# EasyEDA Pro project 毕设.eprj, board PCB1
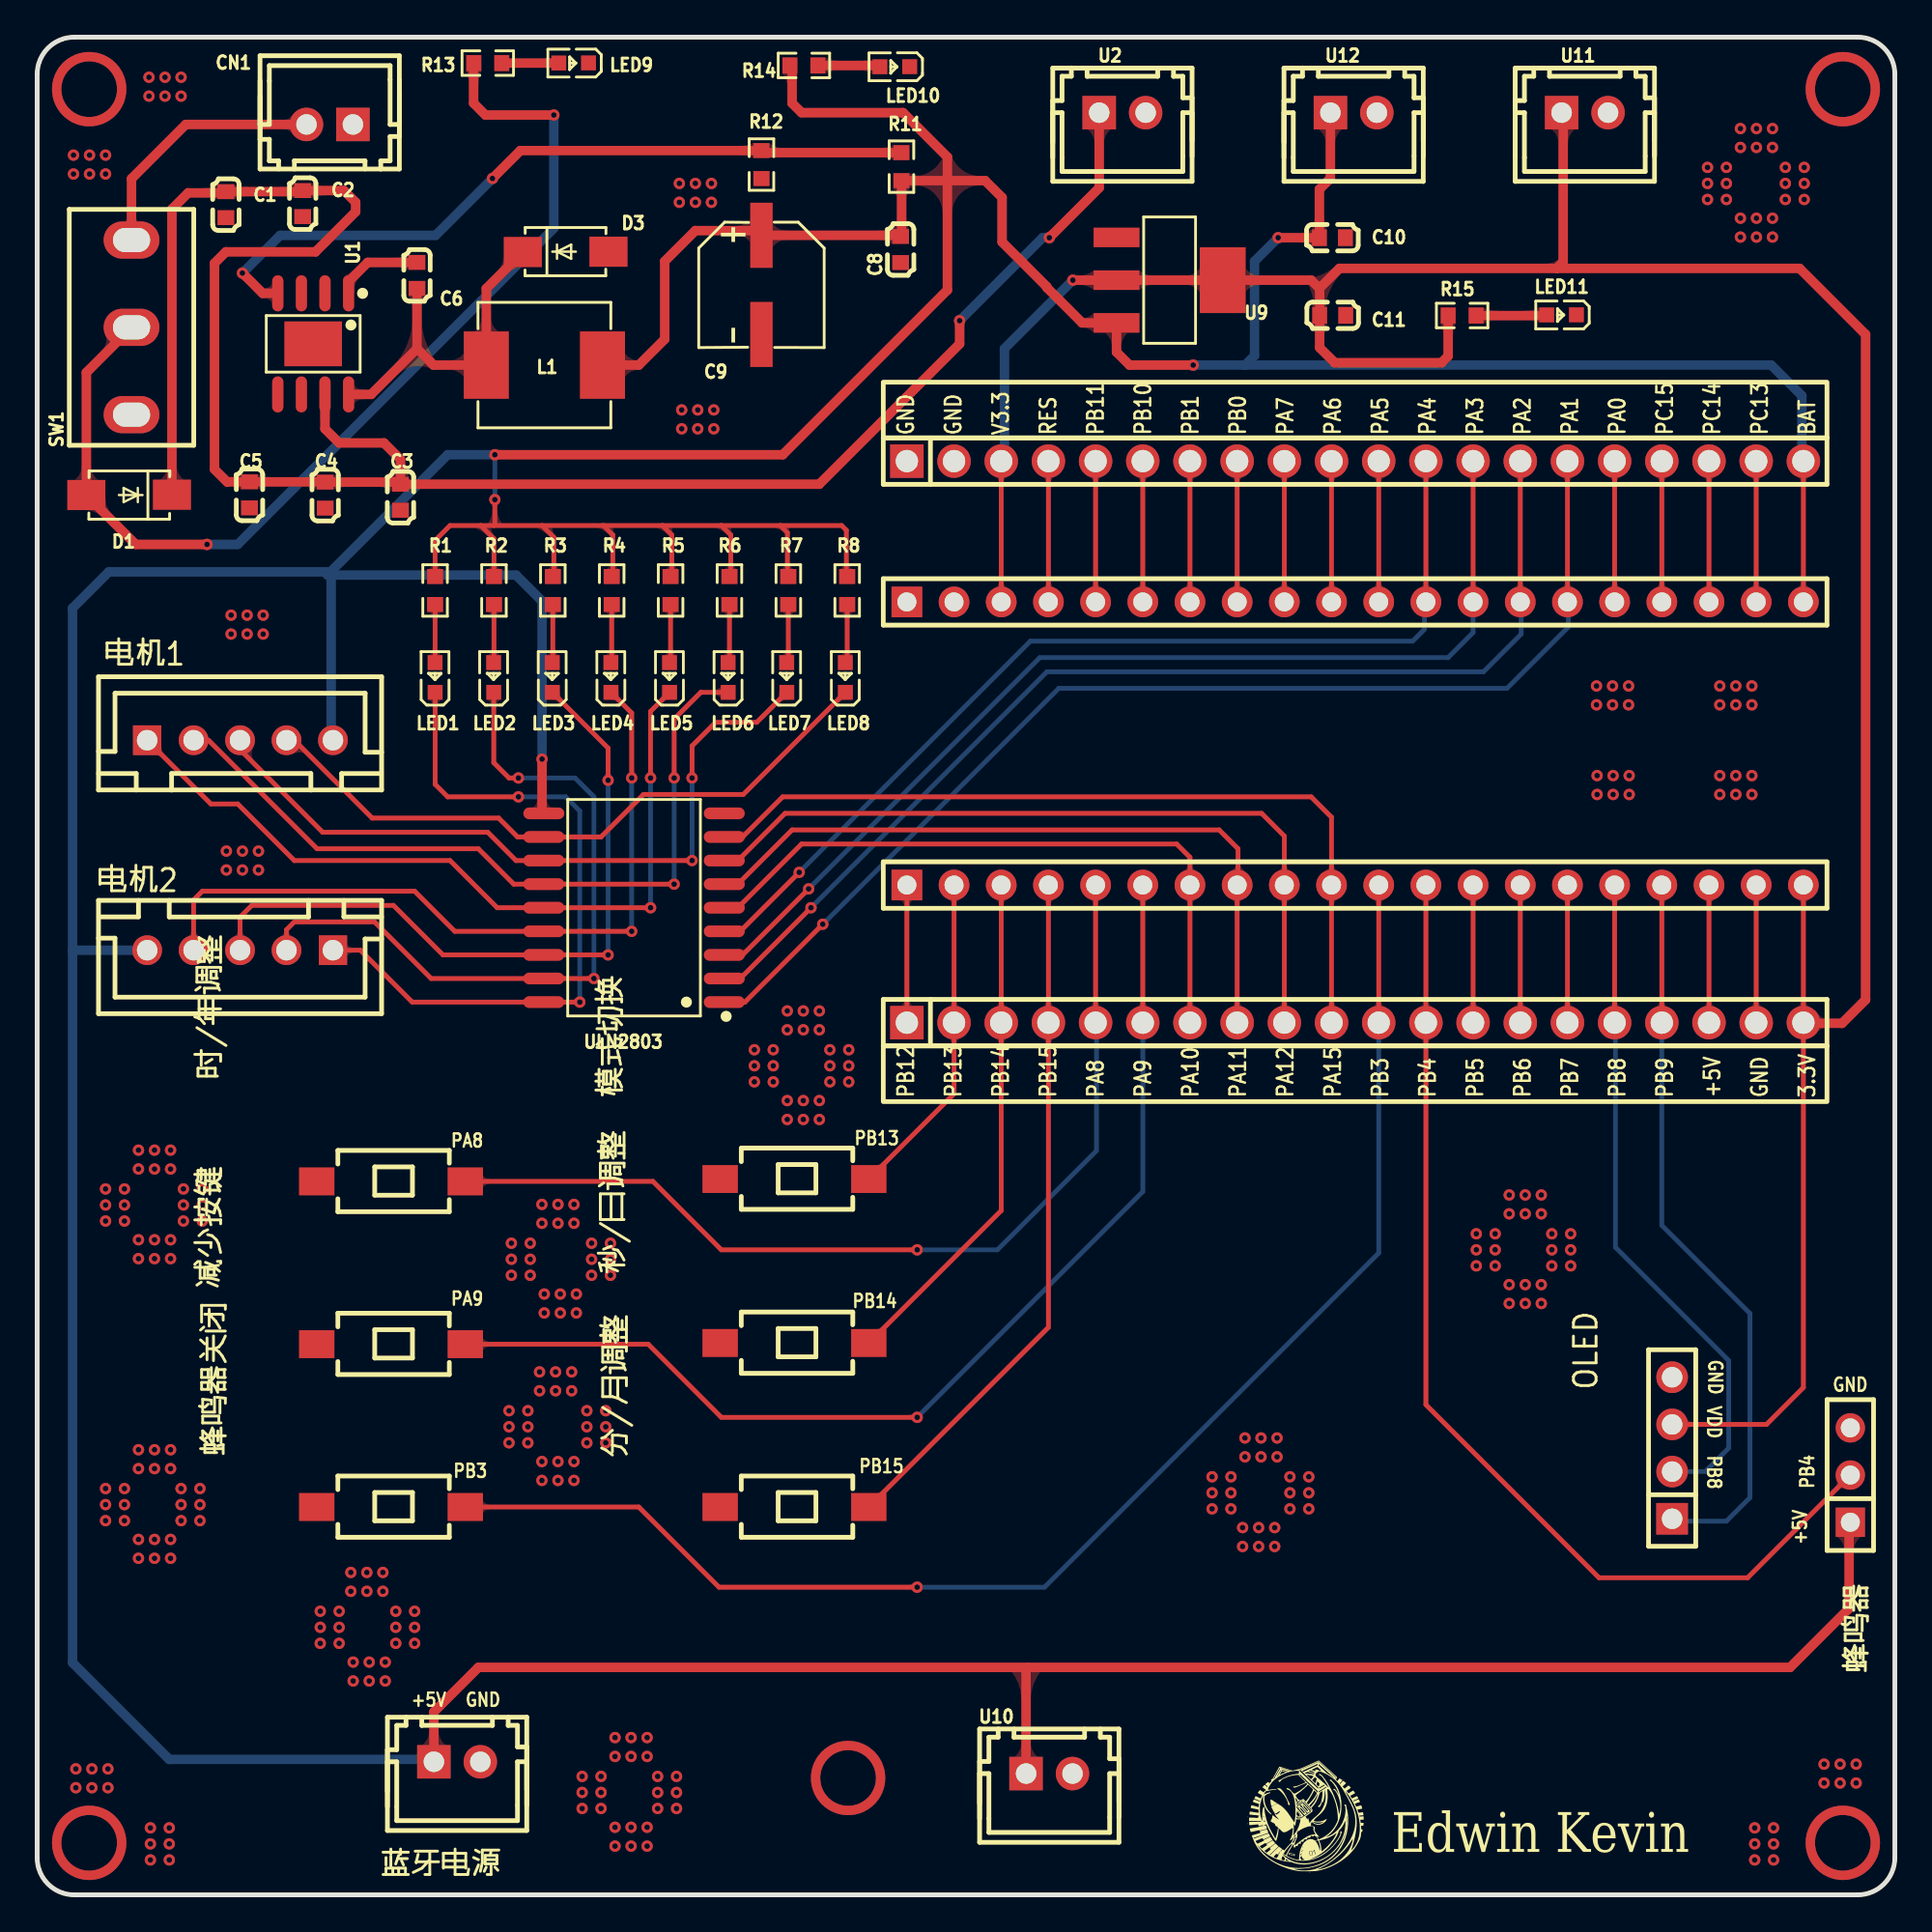
[diagram p1: board, top side]
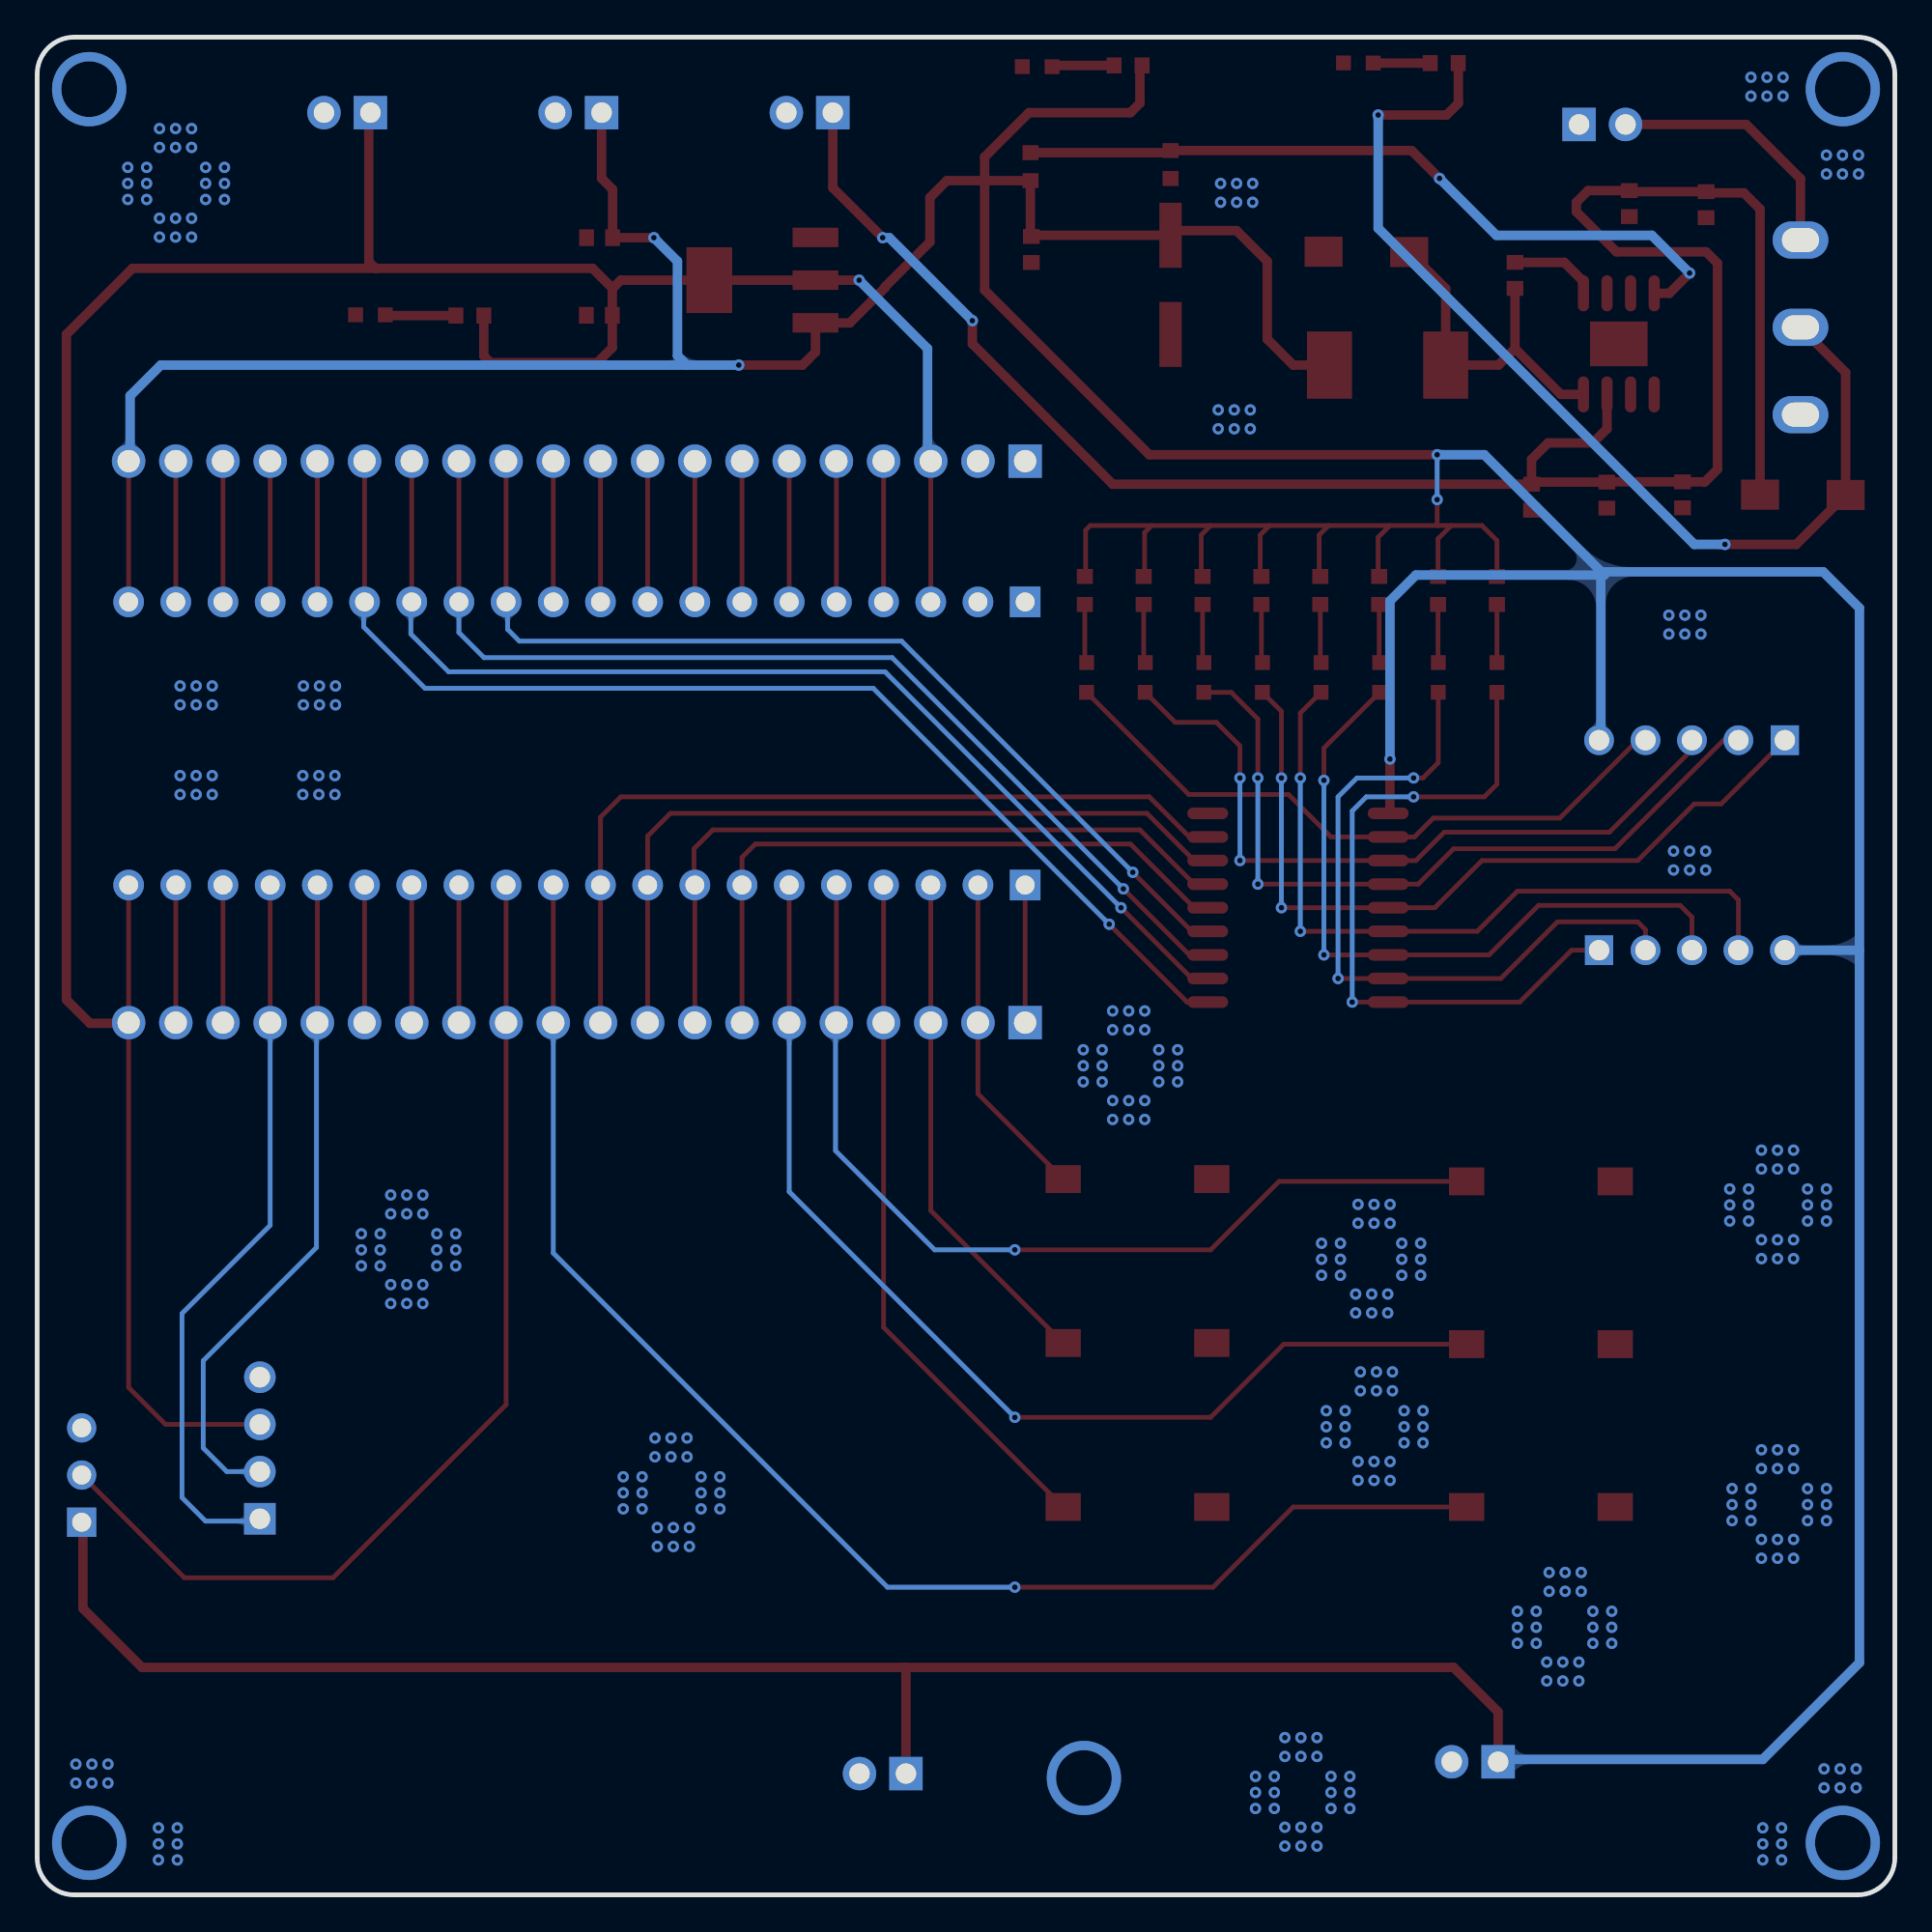
[diagram p2: board, bottom side, seen from below]

Outline 100 x 100 mm; copper layers: Top Layer, Bottom Layer. Coordinates in mm from the lower left corner of the outline.
Outline path: 0,98 0,2 arc(0.59,0.59) 2,0 98,0 arc(99.41,0.59) 100,2 100,98 arc(99.41,99.41) 98,100 2,100 arc(0.59,99.41) 0,98
Stack: Top Layer 0.035mm / Dielectric1 1.51mm FR4 er 4.5 / Bottom Layer 0.035mm

## Design rules (mm)
template: JLCPCB Capability(Two Layers Board)
spacing copperThickness1oz (default): track to track 0.102, other pairs 0.152 to 0.3
spacing copperThickness2oz: track to track 0.203, other pairs 0.152 to 0.3
track width copperThickness1oz (default): min 0.127, default 0.254, max 2.54
track width copperThickness2oz: min 0.203, default 0.254, max 2.54
differential pair differentialPair (default): width min 0.127, default 0.254, max 2.54; gap min 0.152, default 0.152
via viaSize (default): diameter min 0.5, default 0.61, max 10; hole min 0.3, default 0.305, max 6.3

## Placement (name value [footprint] x y rotation side)
C1  100nF  [C0603]  10.16 90.98 270 top
C2  100nF  [C0603]  14.29 91.04 270 top
C3  4.7μF  [C0603]  19.56 75.23 90 top
C4  4.7μF  [C0603]  15.5 75.35 90 top
C5  0.01μF  [C0603]  11.43 75.36 90 top
C6  0.01μF  [C0603]  20.45 87.18 270 top
C8  0.01μF  [C0603]  46.48 88.57 90 top
C9  330uF  [CAP-SMD_BD6.3-L6.6-W6.6-LS7.3-FD]  38.99 86.67 270 top
C10  10μF  [C0603]  69.72 89.2 0 top
C11  10μF  [C0603]  69.74 85.03 180 top
CN1  ZX-XH2.54-2PZZ  [CONN-TH_2P-P2.50_HX25003-2A]  15.75 95.3 180 top
D1  SS54  [SMA_L4.3-W2.6-LS5.0-FD]  4.95 75.36 0 top
D3  SS54  [SMA_L4.3-W2.6-LS5.0-FD]  28.45 88.44 180 top
H2  -  [HDR-TH_20P-P2.54-V-M-1]  70.95 46.95 0 top
H3  -  [HDR-TH_20P-P2.54-V-M-1]  70.95 77.18 0 top
L1  15uH  [IND-SMD_L7.0-W6.6_FXL0630]  27.31 82.35 180 top
LED1  -  [LED_0603]  21.41 65.58 90 top
LED2  -  [LED_0603]  24.57 65.58 90 top
LED3  -  [LED_0603]  27.72 65.58 90 top
LED4  -  [LED_0603]  30.88 65.58 90 top
LED5  -  [LED_0603]  34.03 65.58 90 top
LED6  -  [LED_0603]  37.19 65.58 90 top
LED7  -  [LED_0603]  40.34 65.58 90 top
LED8  -  [LED_0603]  43.5 65.58 90 top
LED9  -  [LED_0603]  28.83 98.6 180 top
LED10  -  [LED_0603]  46.12 98.4 180 top
LED11  -  [LED_0603]  82.01 85.04 180 top
OLED  -  [HDR-TH_4P-P2.54-V-F]  88.01 24.05 90 top
R1  10K  [R0603]  21.42 70.21 90 top
R2  10K  [R0603]  24.59 70.21 90 top
R3  10K  [R0603]  27.76 70.21 90 top
R4  10K  [R0603]  30.93 70.21 90 top
R5  10K  [R0603]  34.1 70.21 90 top
R6  10K  [R0603]  37.27 70.21 90 top
R7  10K  [R0603]  40.44 70.21 90 top
R8  10K  [R0603]  43.6 70.21 90 top
R11  10K  [R0603]  46.52 93.03 270 top
R12  3KΩ  [R0603]  38.99 93.14 90 top
R13  10K  [R0603]  24.26 98.6 180 top
R14  10K  [R0603]  41.28 98.48 0 top
R15  10K  [R0603]  76.71 85.01 0 top
SW1  SS-12D10L5  [SW-TH_SS-12D10L5]  5.08 84.38 90 top
U1  TPS5450QDDARQ1  [SOIC-8_L4.9-W3.9-P1.27-LS6.0-BL-EP]  14.86 83.49 180 top
U2  ZX-XH2.54-2PZZ  [CONN-TH_2P-P2.50_HX25003-2A]  58.42 95.94 0 top
U7  PM254-1-20-Z-8.5  [HDR-TH_20P-P2.54-V-F-2]  70.95 54.36 0 top
U8  PM254-1-20-Z-8.5  [HDR-TH_20P-P2.54-V-F-2]  70.95 69.6 0 top
U9  LM1117IMPX-3.3/NOPB  [SOT-223_L6.5-W3.5-P2.30-LS7.0-BR]  60.96 86.92 180 top
U10  ZX-XH2.54-2PZZ  [CONN-TH_2P-P2.50_HX25003-2A]  54.48 6.53 0 top
U11  ZX-XH2.54-2PZZ  [CONN-TH_2P-P2.50_HX25003-2A]  83.31 95.94 0 top
U12  ZX-XH2.54-2PZZ  [CONN-TH_2P-P2.50_HX25003-2A]  70.87 95.94 0 top
ULN2803  ULN2803  [SOP-18_L11.6-W7.5-P1.27-LS10.3-BL]  32.13 53.14 90 top
减少按键  TS-1101-C-W  [SW-SMD_L6.0-W3.3-LS8.0]  19.05 29.64 180 top
分/月调整  TS-1101-C-W  [SW-SMD_L6.0-W3.3-LS8.0]  40.77 20.88 180 top
时/年调整  TS-1101-C-W  [SW-SMD_L6.0-W3.3-LS8.0]  19.05 38.41 180 top
模式切换  TS-1101-C-W  [SW-SMD_L6.0-W3.3-LS8.0]  40.77 38.53 180 top
电机1  电机1  [CONN-TH_5P-P2.50_ZX-XH2.54-5PZZ]  10.92 62.15 0 top
电机2  电机2  [CONN-TH_5P-P2.50_ZX-XH2.54-5PZZ]  10.92 50.85 180 top
秒/日调整  TS-1101-C-W  [SW-SMD_L6.0-W3.3-LS8.0]  40.77 29.71 180 top
蓝牙电源  ZX-XH2.54-2PZZ  [CONN-TH_2P-P2.50_HX25003-2A]  22.61 7.16 0 top
蜂鸣器  -  [HDR-TH_3P-P2.54-V-F]  97.6 22.6 90 top
蜂鸣器关闭  TS-1101-C-W  [SW-SMD_L6.0-W3.3-LS8.0]  19.05 20.88 180 top

## Footprints (pads in the part's own frame, mm; a bottom-side part is the same pattern mirrored in y, then rotated)
C0603
  rect 0.8x0.9 smd: 1(-0.7,0) 2(0.7,0)
CAP-SMD_BD6.3-L6.6-W6.6-LS7.3-FD
  rect 3.5x1.2 smd: 1(-2.67,0) 2(2.67,0)
CONN-TH_2P-P2.50_HX25003-2A
  rect 1.8x1.8 hole 1.1: 1(-1.25,0)
  round 1.8 hole 1.1: 2(1.25,0)
CONN-TH_5P-P2.50_ZX-XH2.54-5PZZ
  rect 1.524x1.6 hole 1.1: 1(-5,0)
  round 1.6 hole 1.1: 2(-2.5,0) 3(0,0) 4(2.5,0) 5(5,0)
HDR-TH_3P-P2.54-V-F
  rect 1.575x1.575 hole 1.02: 1(-2.54,0)
  round 1.575 hole 1.02: 2(0,0) 3(2.54,0)
HDR-TH_4P-P2.54-V-F
  rect 1.7x1.7 hole 1.1: 1(-3.81,0)
  round 1.7 hole 1.1: 2(-1.27,0) 3(1.27,0) 4(3.81,0)
HDR-TH_20P-P2.54-V-F-2
  rect 1.65x1.65 hole 1.02: 1(-24.13,0)
  round 1.65 hole 1.02: 2(-21.59,0) 3(-19.05,0) 4(-16.51,0) 5(-13.97,0) 6(-11.43,0) 7(-8.89,0) 8(-6.35,0) 9(-3.81,0) 10(-1.27,0) 11(1.27,0) 12(3.81,0) 13(6.35,0) 14(8.89,0) 15(11.43,0) 16(13.97,0) 17(16.51,0) 18(19.05,0) 19(21.59,0) 20(24.13,0)
HDR-TH_20P-P2.54-V-M-1
  rect 1.8x1.8 hole 1.2: 1(-24.13,0)
  round 1.8 hole 1.2: 2(-21.59,0) 3(-19.05,0) 4(-16.51,0) 5(-13.97,0) 6(-11.43,0) 7(-8.89,0) 8(-6.35,0) 9(-3.81,0) 10(-1.27,0) 11(1.27,0) 12(3.81,0) 13(6.35,0) 14(8.89,0) 15(11.43,0) 16(13.97,0) 17(16.51,0) 18(19.05,0) 19(21.59,0) 20(24.13,0)
IND-SMD_L7.0-W6.6_FXL0630
  rect 2.424x3.62 smd: 1(3.128,0) 2(-3.128,0)
LED_0603
  rect 0.8x0.8 smd: 1(-0.851,-0.01) 2(0.75,-0.005)
R0603
  rect 0.806x0.864 smd: 1(-0.753,0) 2(0.753,0)
SMA_L4.3-W2.6-LS5.0-FD
  rect 2.046x1.62 smd: 1(-2.304,-0.009) 2(2.304,0.009)
SOIC-8_L4.9-W3.9-P1.27-LS6.0-BL-EP
  oval 0.602x1.941 smd: 1(-1.905,-2.72) 2(-0.635,-2.72) 3(0.635,-2.72) 4(1.905,-2.72) 5(1.905,2.72) 6(0.635,2.72) 7(-0.635,2.72) 8(-1.905,2.72)
  rect 3.098x2.41 smd: 9(0,0)
SOP-18_L11.6-W7.5-P1.27-LS10.3-BL
  oval 0.63x2.2 smd: 1(-5.08,-4.857) 2(-3.81,-4.857) 3(-2.54,-4.857) 4(-1.27,-4.857) 5(0,-4.857) 6(1.27,-4.857) 7(2.54,-4.857) 8(3.81,-4.857) 9(5.08,-4.857) 10(5.08,4.857) 11(3.81,4.857) 12(2.54,4.857) 13(1.27,4.857) 14(0,4.857) 15(-1.27,4.857) 16(-2.54,4.857) 17(-3.81,4.857) 18(-5.08,4.857)
SOT-223_L6.5-W3.5-P2.30-LS7.0-BR
  rect 2.465x1.05 smd: 1(2.857,-2.3) 2(2.857,0) 3(2.857,2.3)
  rect 2.465x3.54 smd: 4(-2.857,0)
SW-SMD_L6.0-W3.3-LS8.0
  rect 1.9x1.5 smd: 1(-4,0) 2(4,0)
SW-TH_SS-12D10L5
  oval 2x3 hole 1.3x2: 1(-4.7,0) 2(0,0) 3(4.7,0)

## Nets
As in the schematic, except:
$1N15280: C6.2 D3.2 L1.1 U1.8
$1N15281: C6.1 U1.1

Pads without a net: U1 2 3 5

## Via types
v1: diameter 4, hole 2.999, Top Layer to Bottom Layer, 5 vias
v2: diameter 0.61, hole 0.305, Top Layer to Bottom Layer, 357 vias

## Routing (per net, layer and track width the routed paths; a pad name or vN(x,y) marks a point on that pad's centre or on a via; arc(x,y) is an arc through that point)
5V: length 7.4
  Top Layer w0.254: H2.18 U7.18
GND: length 7.4
  Top Layer w0.254: U7.19 H2.19
  vias: v2(1.96,93.65) v2(1.96,92.63) v2(2.08,6.78) v2(2.08,5.77) v2(2.82,93.65) v2(2.82,92.63) v2(2.95,6.78) v2(2.95,5.77) v2(3.68,93.65) v2(3.68,92.63) v2(3.68,38) v2(3.68,37.14) v2(3.68,36.27) v2(3.68,21.87) v2(3.68,21.01) v2(3.68,20.14) v2(3.81,6.78) v2(3.81,5.77) v2(4.7,38) v2(4.7,37.14) v2(4.7,36.27) v2(4.7,21.87) v2(4.7,21.01) v2(4.7,20.14) v2(5.45,40.09) v2(5.45,39.07) v2(5.45,35.26) v2(5.45,34.25) v2(5.45,23.96) v2(5.45,22.94) v2(5.45,19.13) v2(5.45,18.12) v2(6.02,97.84) v2(6.02,96.83) v2(6.1,3.61) v2(6.1,2.74) v2(6.1,1.88) v2(6.32,40.09) v2(6.32,39.07) v2(6.32,35.26) v2(6.32,34.25) v2(6.32,23.96) v2(6.32,22.94) v2(6.32,19.13) v2(6.32,18.12) v2(6.88,97.84) v2(6.88,96.83) v2(7.11,3.61) v2(7.11,2.74) v2(7.11,1.88) v2(7.18,40.09) v2(7.18,39.07) v2(7.18,35.26) v2(7.18,34.25) v2(7.18,23.96) v2(7.18,22.94) v2(7.18,19.13) v2(7.18,18.12) v2(7.75,97.84) v2(7.75,96.83) v2(7.75,21.87) v2(7.75,21.01) v2(7.75,20.14) v2(7.87,38) v2(7.87,37.14) v2(7.87,36.27) v2(8.76,21.87) v2(8.76,21.01) v2(8.76,20.14) v2(8.89,38) v2(8.89,37.14) v2(8.89,36.27) v2(10.19,56.19) v2(10.19,55.17) v2(10.44,68.89) v2(10.44,67.87) v2(11.05,56.19) v2(11.05,55.17) v2(11.3,68.89) v2(11.3,67.87) v2(11.91,56.19) v2(11.91,55.17) v2(12.17,68.89) v2(12.17,67.87) v2(15.24,15.27) v2(15.24,14.4) v2(15.24,13.54) v2(16.26,15.27) v2(16.26,14.4) v2(16.26,13.54) v2(16.88,17.36) v2(16.88,16.34) v2(17.01,12.53) v2(17.01,11.51) v2(17.75,17.36) v2(17.75,16.34) v2(17.87,12.53) v2(17.87,11.51) v2(18.61,17.36) v2(18.61,16.34) v2(18.74,12.53) v2(18.74,11.51) v2(19.3,15.27) v2(19.3,14.4) v2(19.3,13.54) v2(20.32,15.27) v2(20.32,14.4) v2(20.32,13.54) v2(25.4,26.06) v2(25.4,25.2) v2(25.4,24.33) v2(25.53,35.08) v2(25.53,34.21) v2(25.53,33.35) v2(26.42,26.06) v2(26.42,25.2) v2(26.42,24.33) v2(26.54,35.08) v2(26.54,34.21) v2(26.54,33.35) v2(27.04,28.15) v2(27.04,27.13) v2(27.17,37.17) v2(27.17,36.15) v2(27.17,23.32) v2(27.17,22.31) v2(27.3,32.34) v2(27.3,31.33) v2(27.91,28.15) v2(27.91,27.13) v2(28.03,37.17) v2(28.03,36.15) v2(28.03,23.32) v2(28.03,22.31) v2(28.16,32.34) v2(28.16,31.33) v2(28.77,28.15) v2(28.77,27.13) v2(28.9,37.17) v2(28.9,36.15) v2(28.9,23.32) v2(28.9,22.31) v2(29.03,32.34) v2(29.03,31.33) v2(29.34,6.38) v2(29.34,5.51) v2(29.34,4.65) v2(29.59,26.06) v2(29.59,25.2) v2(29.59,24.33) v2(29.84,35.08) v2(29.84,34.21) v2(29.84,33.35) v2(30.35,6.38) v2(30.35,5.51) v2(30.35,4.65) v2(30.61,26.06) v2(30.61,25.2) v2(30.61,24.33) v2(30.86,35.08) v2(30.86,34.21) v2(30.86,33.35) v2(31.11,8.47) v2(31.11,7.45) v2(31.11,3.64) v2(31.11,2.62) v2(31.97,8.47) v2(31.97,7.45) v2(31.97,3.64) v2(31.97,2.62) v2(32.84,8.47) v2(32.84,7.45) v2(32.84,3.64) v2(32.84,2.62) v2(33.4,6.38) v2(33.4,5.51) v2(33.4,4.65) v2(34.42,6.38) v2(34.42,5.51) v2(34.42,4.65) v2(34.57,92.13) v2(34.57,91.11) v2(34.7,79.93) v2(34.7,78.92) v2(35.43,92.13) v2(35.43,91.11) v2(35.56,79.93) v2(35.56,78.92) v2(36.3,92.13) v2(36.3,91.11) v2(36.42,79.93) v2(36.42,78.92) v2(38.61,45.49) v2(38.61,44.63) v2(38.61,43.76) v2(39.62,45.49) v2(39.62,44.63) v2(39.62,43.76) v2(40.38,47.58) v2(40.38,46.57) v2(40.38,42.76) v2(40.38,41.74) v2(41.24,47.58) v2(41.24,46.57) v2(41.24,42.76) v2(41.24,41.74) v2(42.11,47.58) v2(42.11,46.57) v2(42.11,42.76) v2(42.11,41.74) v2(42.67,45.49) v2(42.67,44.63) v2(42.67,43.76) v2(43.69,45.49) v2(43.69,44.63) v2(43.69,43.76) v2(63.25,22.5) v2(63.25,21.64) v2(63.25,20.78) v2(64.26,22.5) v2(64.26,21.64) v2(64.26,20.78) v2(64.89,19.77) v2(64.89,18.75) v2(65.02,24.59) v2(65.02,23.58) v2(65.75,19.77) v2(65.75,18.75) v2(65.88,24.59) v2(65.88,23.58) v2(66.62,19.77) v2(66.62,18.75) v2(66.74,24.59) v2(66.74,23.58) v2(67.44,22.5) v2(67.44,21.64) v2(67.44,20.78) v2(68.45,22.5) v2(68.45,21.64) v2(68.45,20.78) v2(77.47,35.59) v2(77.47,34.72) v2(77.47,33.86) v2(78.49,35.59) v2(78.49,34.72) v2(78.49,33.86) v2(79.24,37.68) v2(79.24,36.66) v2(79.24,32.85) v2(79.24,31.83) v2(80.1,37.68) v2(80.1,36.66) v2(80.1,32.85) v2(80.1,31.83) v2(80.97,37.68) v2(80.97,36.66) v2(80.97,32.85) v2(80.97,31.83) v2(81.53,35.59) v2(81.53,34.72) v2(81.53,33.86) v2(82.55,35.59) v2(82.55,34.72) v2(82.55,33.86) v2(83.94,65.08) v2(83.94,64.06) v2(83.97,60.25) v2(83.97,59.23) v2(84.8,65.08) v2(84.8,64.06) v2(84.84,60.25) v2(84.84,59.23) v2(85.67,65.08) v2(85.67,64.06) v2(85.7,60.25) v2(85.7,59.23) v2(89.92,92.99) v2(89.92,92.13) v2(89.92,91.26) v2(90.58,65.08) v2(90.58,64.06) v2(90.58,60.25) v2(90.58,59.23) v2(90.93,92.99) v2(90.93,92.13) v2(90.93,91.26) v2(91.44,65.08) v2(91.44,64.06) v2(91.44,60.25) v2(91.44,59.23) v2(91.69,95.08) v2(91.69,94.06) v2(91.69,90.25) v2(91.69,89.24) v2(92.3,65.08) v2(92.3,64.06) v2(92.3,60.25) v2(92.3,59.23) v2(92.46,3.61) v2(92.46,2.74) v2(92.46,1.88) v2(92.55,95.08) v2(92.55,94.06) v2(92.55,90.25) v2(92.55,89.24) v2(93.41,95.08) v2(93.41,94.06) v2(93.41,90.25) v2(93.41,89.24) v2(93.47,3.61) v2(93.47,2.74) v2(93.47,1.88) v2(94.11,92.99) v2(94.11,92.13) v2(94.11,91.26) v2(95.12,92.99) v2(95.12,92.13) v2(95.12,91.26) v2(96.19,7.04) v2(96.19,6.02) v2(97.05,7.04) v2(97.05,6.02) v2(97.92,7.04) v2(97.92,6.02)
VCC12V: length 113.4
  Top Layer w0.508: v2(54.48,89.2) 57.17,91.89 U2.1 ; U1.7 15.49,78.92 16.26,78.16 18.67,78.16 19.56,77.27 C3.2 42.1,75.94 49.66,83.49 v2(49.66,84.74) ; 10.24,76.06 C5.2 15.49,76.06 C4.2 19.45,76.05 ; D1.2 7.26,90.75 8.13,91.62 10.09,91.62 C1.1 14.24,91.68 C2.1 16.52,91.74 17.14,91.11 17.14,90.6 14.99,88.44 10.16,88.44 9.55,87.83 9.55,76.74 10.24,76.04
  Bottom Layer w0.508: v2(49.66,84.74) 54.12,89.2 v2(54.48,89.2)
VCC+3.3V: length 159.7
  Top Layer w0.254: H3.3 U8.3 ; OLED.3 93.09,25.32 95.08,27.31 H2.20 U7.20
  Top Layer w0.508: 69.02,86.47 70.1,87.55 81.79,87.55 ; 69.02,86.47 69.04,86.46 C11.2 69.04,83.29 69.85,82.47 75.6,82.47 75.95,82.83 R15.1 ; 69.02,86.47 68.58,86.92 U9.4 U9.2 v2(55.75,86.92) ; H2.20 95.11,46.91 97.16,46.91 98.43,48.18 98.43,84 94.87,87.55 81.79,87.55 ; U11.1 82.15,95.85 82.15,87.91 81.79,87.55
  Bottom Layer w0.508: v2(55.75,86.92) 52.07,83.24 52.07,77.35 H3.3
VCC+5V: length 436.3
  Top Layer w0.254: 36.83,73.71 37.34,73.2 37.34,71.04 R6.2 ; 36.83,73.71 33.66,73.71 ; 36.83,73.71 40,73.71 ; 30.48,73.71 30.99,73.2 30.99,71.03 R4.2 ; 30.48,73.71 27.18,73.71 ; 30.48,73.71 33.66,73.71 ; 27.18,73.71 24.59,73.71 ; 27.18,73.71 27.81,73.08 27.81,71.02 R3.2 ; 40,73.71 43.31,73.71 43.56,73.46 43.56,71.01 R8.2 ; 40,73.71 40.39,73.33 40.39,71.02 R7.2 ; 23.88,73.71 22.22,73.71 21.42,72.91 R1.2 ; 23.88,73.71 24.59,73 R2.2 ; 23.88,73.71 24.59,73.71 ; 24.59,73.71 24.64,73.76 v2(24.64,75.11) ; U8.20 H3.20 ; 33.66,73.71 34.16,73.2 34.16,71.03 R5.2
  Top Layer w0.508: R11.2 49,92.28 ; 49,92.28 49,86.39 40.13,77.52 v2(24.64,77.52) ; 49,92.28 51.03,92.28 51.94,91.36 51.94,88.97 54.35,86.57 54.35,86.52 56.25,84.62 U9.3 58.1,83.05 58.8,82.35 v2(62.23,82.35) ; 49,92.28 49,93.55 46.61,95.94 41.15,95.94 40.64,96.44 40.64,98.36 ; v2(66.8,89.2) C10.1 69.02,91.81 69.62,92.4 U12.1 ; 蜂鸣器.1 97.54,19.99 97.54,15.42 94.36,12.24 53.33,12.24 ; 蓝牙电源.1 21.36,9.85 23.75,12.24 53.33,12.24 ; U10.1 53.23,12.15 53.33,12.24 ; v2(27.18,61.14) 27.18,58.31 ; 46.53,92.27 46.53,89.32 C8.2 46.42,89.33 C9.1 38.74,89.59 35.43,89.59 33.78,87.94 33.78,83.74 32.38,82.35 L1.2
  Bottom Layer w0.254: v2(24.64,77.52) v2(24.64,75.11)
  Bottom Layer w0.508: 15.62,71.04 15.83,71.04 ; 15.83,71.04 25.78,71.04 27.18,69.65 v2(27.18,61.14) ; 15.83,71.04 15.83,62.25 电机1.5 ; 1.91,50.81 1.91,12.5 7.11,7.29 21.23,7.29 蓝牙电源.1 ; 1.91,50.81 1.94,50.85 电机2.5 ; 1.91,50.81 1.91,69.27 3.86,71.22 15.8,71.22 22.1,77.52 v2(24.64,77.52) ; H3.20 95,77.26 95,80.7 93.34,82.35 65.02,82.35 ; 65.02,82.35 65.53,82.86 65.53,87.94 v2(66.8,89.2) ; 65.02,82.35 v2(62.23,82.35)
(no net):
  vias: v1(2.8,97.2) v1(2.8,2.8) v1(43.65,6.29) v1(97.2,97.2) v1(97.2,2.8)
1C: length 38.1
  Top Layer w0.254: LED1.1 21.42,59.78 22.1,59.11 v2(25.91,59.11) ; 电机2.1 17.4,50.85 20.19,48.06 ULN2803.18 v2(29.21,48.06)
  Bottom Layer w0.254: v2(25.91,59.11) 28.45,59.11 29.21,58.34 v2(29.21,48.06)
2C: length 38.8
  Top Layer w0.254: v2(29.97,49.33) ULN2803.17 21.21,49.33 18.16,52.38 13.84,52.38 13.42,51.95 电机2.2 ; LED2.1 24.58,60.94 25.4,60.12 v2(25.91,60.12)
  Bottom Layer w0.254: v2(29.97,49.33) 29.97,59.11 28.96,60.12 v2(25.91,60.12)
3C: length 38.3
  Top Layer w0.254: v2(30.73,60) 30.73,61.73 LED3.1 ; 电机2.3 10.92,52.63 11.56,53.26 19.18,53.26 21.84,50.6 ULN2803.16 v2(30.73,50.6)
  Bottom Layer w0.254: v2(30.73,60) v2(30.73,50.6)
4C: length 40.7
  Top Layer w0.254: 30.89,64.73 32,63.62 v2(32,60.12) ; 电机2.4 8.42,53.56 8.89,54.03 20.32,54.03 22.48,51.87 ULN2803.15 v2(32,51.87)
  Bottom Layer w0.254: v2(32,60.12) v2(32,51.87)
5C: length 42.9
  Top Layer w0.254: v2(33.02,53.14) ULN2803.14 24.77,53.14 22.22,55.68 13.84,55.68 10.8,58.72 9.35,58.72 电机1.1 ; v2(33.02,60.12) 33.02,63.71 LED5.1
  Bottom Layer w0.254: v2(33.02,60.12) v2(33.02,53.14)
6C: length 41.5
  Top Layer w0.254: v2(34.29,54.41) ULN2803.13 25.65,54.41 23.75,56.31 15.07,56.31 9.22,62.15 电机1.2 ; v2(34.29,60.12) 34.29,63.3 35.73,64.73 37.2,64.73
  Bottom Layer w0.254: v2(34.29,60.12) v2(34.29,54.41)
7C: length 39.8
  Top Layer w0.254: 电机1.3 11.05,62.03 11.05,61.52 15.37,57.2 24.26,57.2 25.78,55.68 ULN2803.12 v2(35.25,55.68) ; LED7.1 38.74,63.12 36.52,63.12 35.25,61.85 v2(35.25,60.12)
  Bottom Layer w0.254: v2(35.25,60.12) v2(35.25,55.68)
8C: length 35.5
  Top Layer w0.254: LED8.1 38.01,59.23 32.64,59.23 30.35,56.95 ULN2803.11 25.86,56.95 24.84,57.96 18.03,57.96 13.84,62.15 电机1.4
PA0: length 7.6
  Top Layer w0.254: U8.16 H3.16
PA1: length 62.7
  Top Layer w0.254: ULN2803.1 38.1,48.06 v2(42.29,52.25) ; H3.15 U8.15
  Bottom Layer w0.254: v2(42.29,52.25) 54.99,64.95 79.12,64.95 82.42,68.25 82.42,69.55 U8.15
PA2: length 59.9
  Top Layer w0.254: v2(41.66,53.14) 37.85,49.33 ULN2803.2 ; U8.14 H3.14
  Bottom Layer w0.254: v2(41.66,53.14) 54.36,65.84 77.85,65.84 79.88,67.87 79.88,69.55 U8.14
PA3: length 56.7
  Top Layer w0.254: ULN2803.3 37.97,50.6 v2(41.53,54.15) ; H3.13 U8.13
  Bottom Layer w0.254: v2(41.53,54.15) 53.97,66.6 75.95,66.6 77.3,67.95 U8.13
PA4: length 53.5
  Top Layer w0.254: ULN2803.4 37.85,51.87 v2(41.02,55.04) ; U8.12 H3.12
  Bottom Layer w0.254: v2(41.02,55.04) 53.47,67.49 74.04,67.49 74.68,68.12 74.68,69.52 U8.12
PA5: length 7.6
  Top Layer w0.254: H3.11 U8.11
PA6: length 7.6
  Top Layer w0.254: U8.10 H3.10
PA7: length 7.6
  Top Layer w0.254: H3.9 U8.9
PA8: length 52
  Top Layer w0.254: U7.5 H2.5 ; v2(47.37,34.72) 36.83,34.72 33.15,38.41 时/年调整.1
  Bottom Layer w0.254: H2.5 57.02,46.91 57.02,40.06 51.69,34.72 v2(47.37,34.72)
PA9: length 59.6
  Top Layer w0.254: H2.6 U7.6 ; 减少按键.1 32.89,29.64 36.83,25.71 v2(47.37,25.71)
  Bottom Layer w0.254: H2.6 59.52,37.85 v2(47.37,25.71)
PA10: length 35.7
  Top Layer w0.254: H2.7 U7.7 62.06,55.85 61.34,56.57 41.15,56.57 37.72,53.14 ULN2803.5
PA11: length 38.7
  Top Layer w0.254: ULN2803.6 37.72,54.41 40.64,57.33 63.63,57.33 64.64,56.31 64.64,54.41 U7.8 H2.8
PA12: length 41.7
  Top Layer w0.254: H2.9 U7.9 67.14,56.99 65.91,58.22 40.26,58.22 37.72,55.68 ULN2803.7
PA15: length 45.1
  Top Layer w0.254: ULN2803.8 37.97,56.95 40.13,59.11 68.58,59.11 69.68,58.01 U7.10 H2.10
PB0: length 7.6
  Top Layer w0.254: U8.8 H3.8
PB1: length 7.6
  Top Layer w0.254: H3.7 U8.7
PB3: length 78.2
  Top Layer w0.254: 蜂鸣器关闭.1 32.38,20.88 36.7,16.56 v2(47.37,16.56) ; U7.11 H2.11
  Bottom Layer w0.254: H2.11 72.22,34.55 54.23,16.56 v2(47.37,16.56)
PB4: length 57
  Top Layer w0.254: 蜂鸣器.2 92.07,17.07 84.07,17.07 74.76,26.39 H2.12 U7.12
PB5: length 7.4
  Top Layer w0.254: U7.13 H2.13
PB6: length 7.4
  Top Layer w0.254: H2.14 U7.14
PB7: length 7.4
  Top Layer w0.254: U7.15 H2.15
PB8: length 36.4
  Top Layer w0.254: H2.16 U7.16
  Bottom Layer w0.254: OLED.2 89.79,22.78 91.06,24.05 91.06,28.75 84.96,34.85 84.96,46.91 H2.16
PB9: length 39.7
  Top Layer w0.254: U7.17 H2.17
  Bottom Layer w0.254: H2.17 87.46,36.04 92.2,31.29 92.2,21.39 90.93,20.12 88.14,20.12 OLED.1
PB10: length 7.6
  Top Layer w0.254: U8.6 H3.6
PB11: length 7.6
  Top Layer w0.254: H3.5 U8.5
PB12: length 7.4
  Top Layer w0.254: U7.1 H2.1
PB13: length 17.7
  Top Layer w0.254: U7.2 H2.2 49.36,43.12 模式切换.1
PB14: length 27.6
  Top Layer w0.254: 秒/日调整.1 51.9,36.84 H2.3 U7.3
PB15: length 37.5
  Top Layer w0.254: 分/月调整.1 54.44,30.55 H2.4 U7.4
PC13: length 7.6
  Top Layer w0.254: H3.19 U8.19
PC14: length 7.6
  Top Layer w0.254: U8.18 H3.18
PC15: length 7.6
  Top Layer w0.254: H3.17 U8.17
RES: length 7.6
  Top Layer w0.254: U8.4 H3.4
$1N3478: length 3.1
  Top Layer w0.254: R1.1 21.42,66.33
$1N3503: length 3.1
  Top Layer w0.254: LED2.2 24.59,66.35 R2.1
$1N3528: length 3.1
  Top Layer w0.254: R3.1 27.76,66.36 LED3.2
$1N3553: length 3.1
  Top Layer w0.254: LED4.2 30.93,66.38 R4.1
$1N3578: length 3.2
  Top Layer w0.254: LED5.2 34.1,66.39 R5.1
$1N3603: length 3.2
  Top Layer w0.254: R6.1 37.27,66.41 LED6.2
$1N3628: length 3.2
  Top Layer w0.254: R7.1 40.44,66.42 LED7.2
$1N3653: length 3.2
  Top Layer w0.254: LED8.2 43.6,66.43 R8.1
$1N15280: length 18.4
  Top Layer w0.508: 23.67,82.35 21.34,82.35 20.45,83.24 ; 20.45,83.24 17.98,80.77 U1.8 ; 20.45,83.24 C6.2 ; L1.1 24.18,86.47 D3.2
$1N15281: length 4.1
  Top Layer w0.508: 16.76,86.85 17.79,87.88 C6.1
$1N15282: length 40.6
  Top Layer w0.508: 46.52,93.78 39.1,93.78 R12.2 26.01,93.9 v2(24.51,92.39) ; v2(11.05,87.3) 12.14,86.21 U1.4
  Bottom Layer w0.508: v2(11.05,87.3) 13.08,89.33 21.45,89.33 v2(24.51,92.39)
$1N15283: length 3.1
  Top Layer w0.508: R13.1 28.07,98.6 LED9.2
$1N15288: length 3.4
  Top Layer w0.508: R14.2 45.3,98.48 LED10.2
$1N16489: length 3.8
  Top Layer w0.508: R15.2 81.22,85.01 LED11.2
$1N16563: length 56.2
  Top Layer w0.508: v2(27.81,95.81) 24.13,95.81 23.5,96.44 23.5,98.59 R13.2 ; v2(9.14,72.69) 5.31,72.69 D1.1 2.65,81.95 SW1.2
  Bottom Layer w0.508: v2(9.14,72.69) 10.8,72.69 27.81,89.71 v2(27.81,95.81)
$1N16571: length 13.9
  Top Layer w0.508: SW1.3 5.08,92.38 8,95.3 CN1.2

Small or netless copper shapes (teardrops, artwork), in the pictures only: 261 on Top Layer, 52 on Bottom Layer

## Text on the board
Top Silkscreen Layer: +5V | GND | VDD | PB8 | PA8 | PA9 | PB3 | PB14 | PB13 | PB15 | PB4 | PB12 | V3.3 | RES | PB11 | PB10 | PB1 | PA10 | PB0 | PA11 | PA7 | PA12 | PA6 | PA15 | PA5 | PA4 | PA3 | PB5 | PA2 | PB6 | PA1 | PB7 | PA0 | PC15 | PB9 | PC14 | PC13 | BAT | 3.3V | Edwin Kevin
